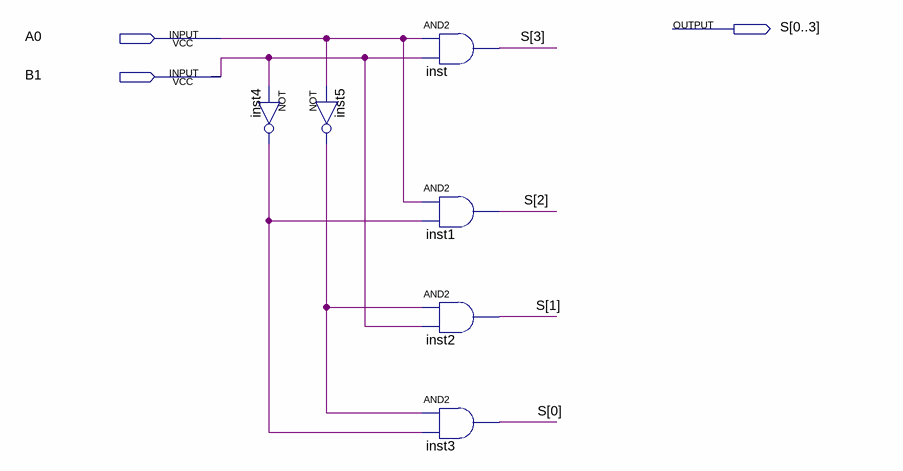
[diagram p0: schematic sheet]
// Quartus schematic decod.bdf as structural Verilog: 6 symbols, 3 pins
module decod (
  input  A0,
  input  B1,
  output [0:3] S
);

  wire inst4_out, inst5_out;

  not inst5 (inst5_out, A0);
  not inst4 (inst4_out, B1);
  and inst (S[3], A0, B1);
  and inst1 (S[2], A0, inst4_out);
  and inst2 (S[1], inst5_out, B1);
  and inst3 (S[0], inst5_out, inst4_out);
endmodule
